# Altium schematic sheet 11_RSSI2.SchDoc: RSSI2
size A3; Organization: Lime Microsystems; Address1: Surrey Tech Centre; Address2: Guildford GU2 7YG; Address3: Surrey; Address4: United Kingdom; Revision: v1.2; SheetNumber: 9; SheetTotal: 27
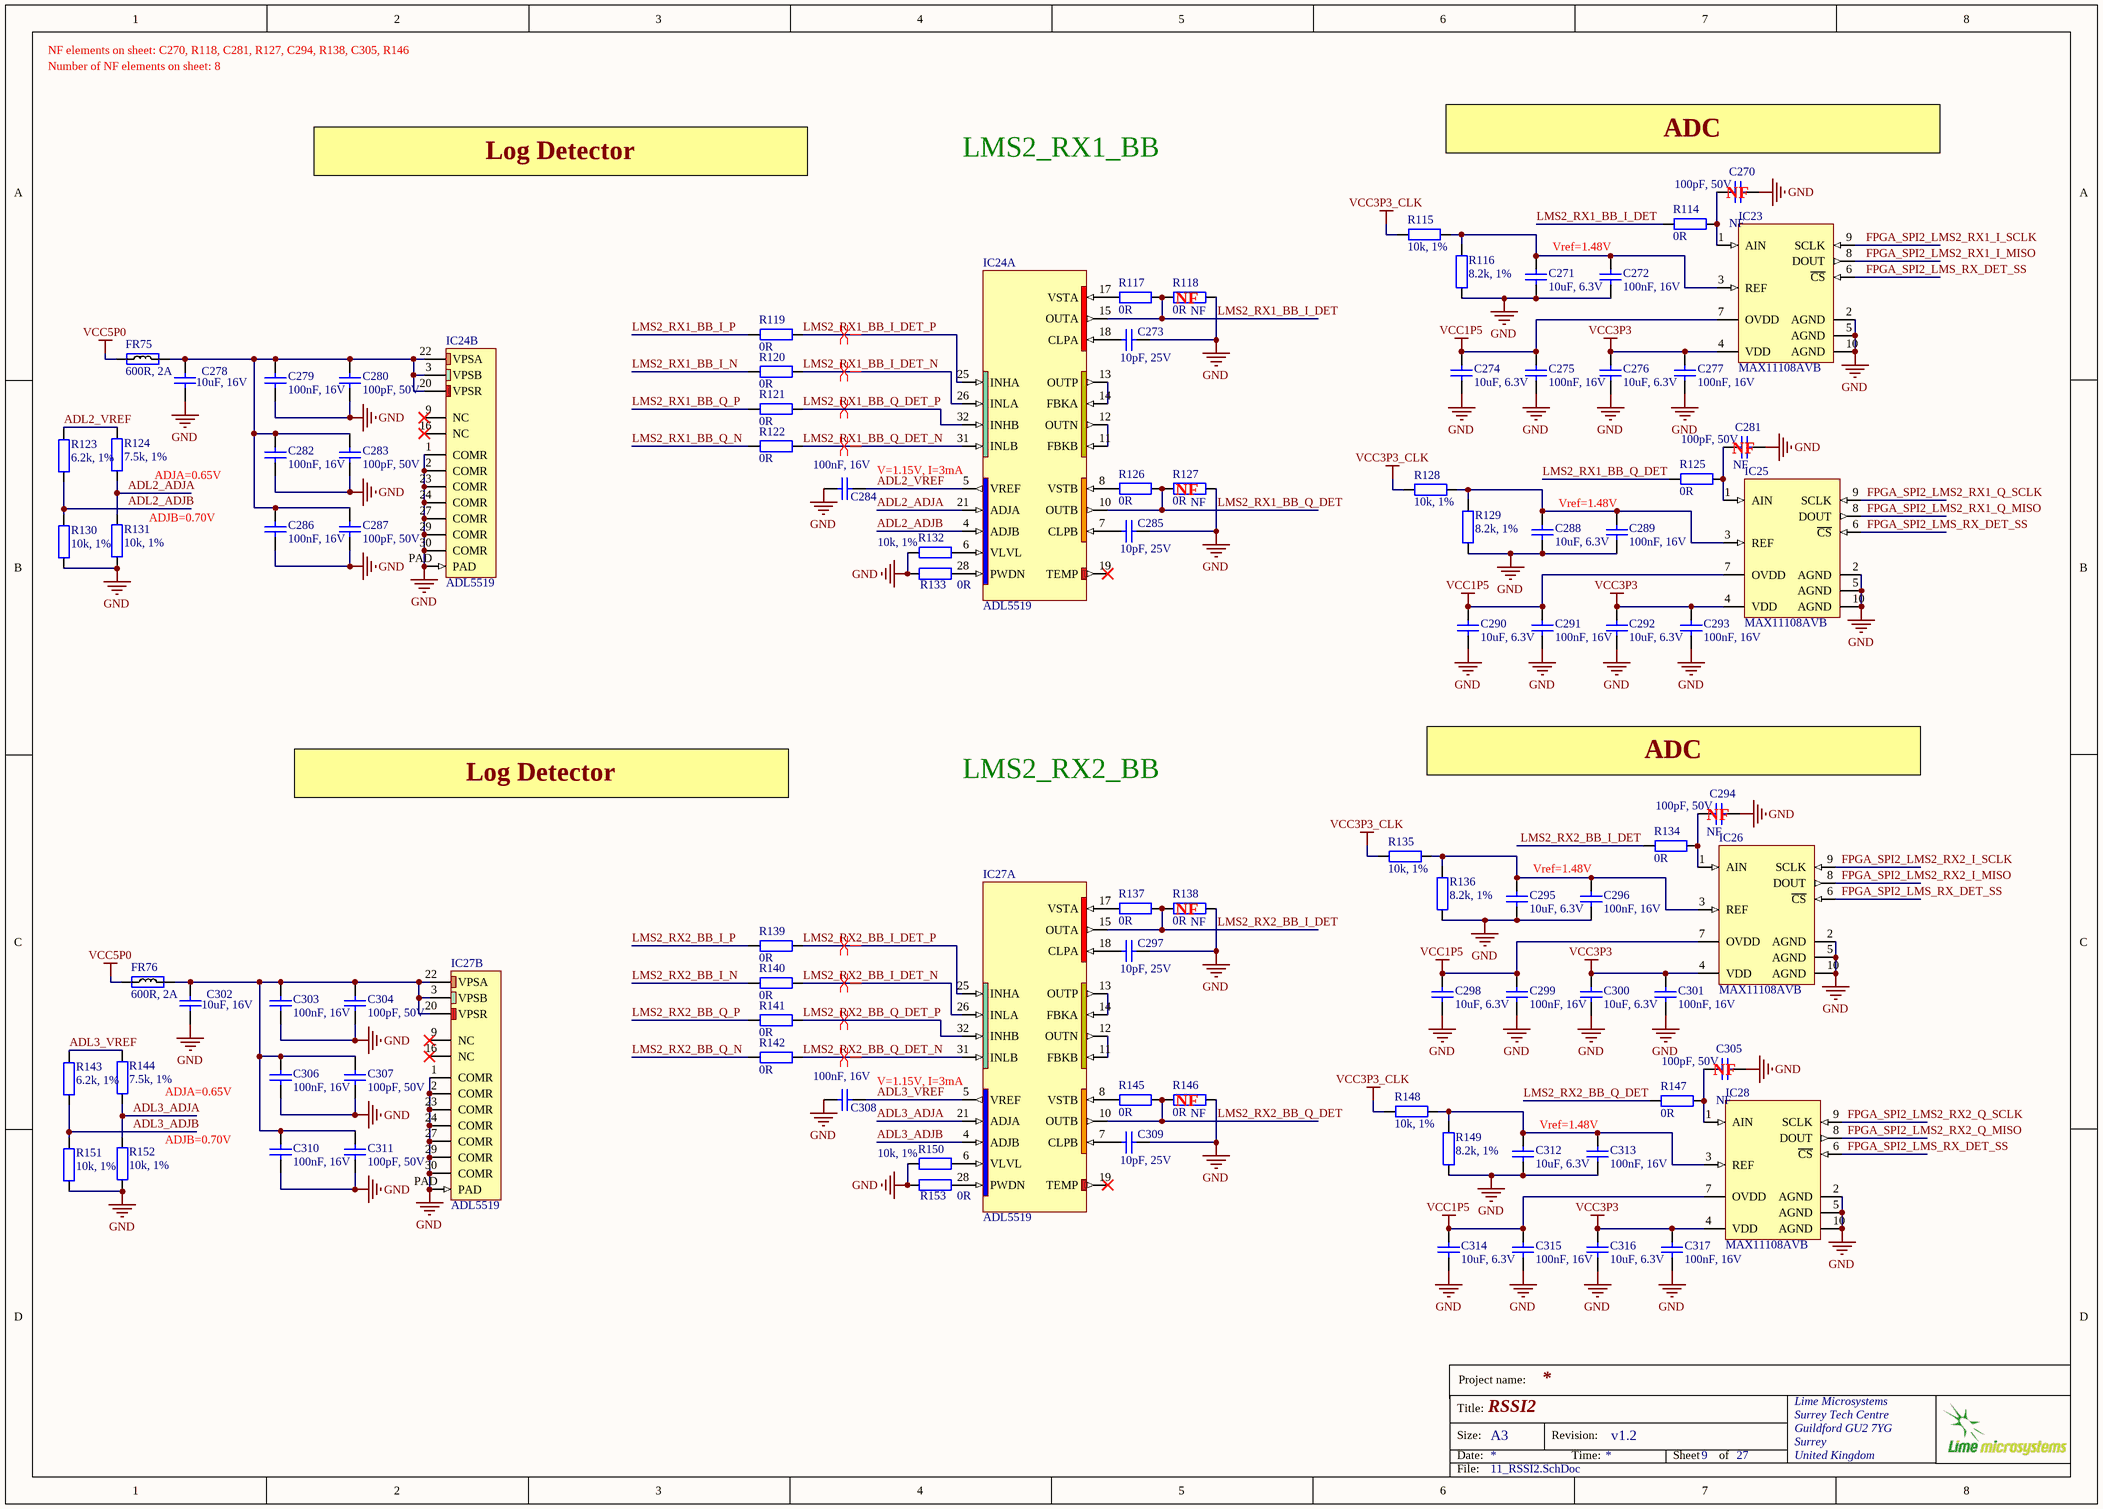
[diagram p0: 11_RSSI2.SchDoc]

## Parts
C270  100pF, 50V  Assembly Info: NF  [CAP0402]
C271  10uF, 6.3V  [CAP0603]
C272  100nF, 16V  [CAP0402]
C273  10pF, 25V  [CAP0402]
C274  10uF, 6.3V  [CAP0603]
C275  100nF, 16V  [CAP0402]
C276  10uF, 6.3V  [CAP0603]
C277  100nF, 16V  [CAP0402]
C278  10uF, 16V  [CAP0603]
C279  100nF, 16V  [CAP0402]
C280  100pF, 50V  [CAP0402]
C281  100pF, 50V  Assembly Info: NF  [CAP0402]
C282  100nF, 16V  [CAP0402]
C283  100pF, 50V  [CAP0402]
C284  100nF, 16V  [CAP0402]
C285  10pF, 25V  [CAP0402]
C286  100nF, 16V  [CAP0402]
C287  100pF, 50V  [CAP0402]
C288  10uF, 6.3V  [CAP0603]
C289  100nF, 16V  [CAP0402]
C290  10uF, 6.3V  [CAP0603]
C291  100nF, 16V  [CAP0402]
C292  10uF, 6.3V  [CAP0603]
C293  100nF, 16V  [CAP0402]
C294  100pF, 50V  Assembly Info: NF  [CAP0402]
C295  10uF, 6.3V  [CAP0603]
C296  100nF, 16V  [CAP0402]
C297  10pF, 25V  [CAP0402]
C298  10uF, 6.3V  [CAP0603]
C299  100nF, 16V  [CAP0402]
C300  10uF, 6.3V  [CAP0603]
C301  100nF, 16V  [CAP0402]
C302  10uF, 16V  [CAP0603]
C303  100nF, 16V  [CAP0402]
C304  100pF, 50V  [CAP0402]
C305  100pF, 50V  Assembly Info: NF  [CAP0402]
C306  100nF, 16V  [CAP0402]
C307  100pF, 50V  [CAP0402]
C308  100nF, 16V  [CAP0402]
C309  10pF, 25V  [CAP0402]
C310  100nF, 16V  [CAP0402]
C311  100pF, 50V  [CAP0402]
C312  10uF, 6.3V  [CAP0603]
C313  100nF, 16V  [CAP0402]
C314  10uF, 6.3V  [CAP0603]
C315  100nF, 16V  [CAP0402]
C316  10uF, 6.3V  [CAP0603]
C317  100nF, 16V  [CAP0402]
FR75  600R, 2A  [RES0805]
FR76  600R, 2A  [RES0805]
IC23  MAX11108AVB  [MAX11108AVB+T]
IC24  ADL5519  [ADL5519_32LFCSP]  (parts A,B of 2)
IC25  MAX11108AVB  [MAX11108AVB+T]
IC26  MAX11108AVB  [MAX11108AVB+T]
IC27  ADL5519  [ADL5519_32LFCSP]  (parts A,B of 2)
IC28  MAX11108AVB  [MAX11108AVB+T]
R114  0R  [RES0402]
R115  10k, 1%  [RES0402]
R116  8.2k, 1%  [RES0402]
R117  0R  [RES0402]
R118  0R  Assembly Info: NF  [RES0402]
R119  0R  [RES0402]
R120  0R  [RES0402]
R121  0R  [RES0402]
R122  0R  [RES0402]
R123  6.2k, 1%  [RES0402]
R124  7.5k, 1%  [RES0402]
R125  0R  [RES0402]
R126  0R  [RES0402]
R127  0R  Assembly Info: NF  [RES0402]
R128  10k, 1%  [RES0402]
R129  8.2k, 1%  [RES0402]
R130  10k, 1%  [RES0402]
R131  10k, 1%  [RES0402]
R132  10k, 1%  [RES0402]
R133  0R  [RES0402]
R134  0R  [RES0402]
R135  10k, 1%  [RES0402]
R136  8.2k, 1%  [RES0402]
R137  0R  [RES0402]
R138  0R  Assembly Info: NF  [RES0402]
R139  0R  [RES0402]
R140  0R  [RES0402]
R141  0R  [RES0402]
R142  0R  [RES0402]
R143  6.2k, 1%  [RES0402]
R144  7.5k, 1%  [RES0402]
R145  0R  [RES0402]
R146  0R  Assembly Info: NF  [RES0402]
R147  0R  [RES0402]
R148  10k, 1%  [RES0402]
R149  8.2k, 1%  [RES0402]
R150  10k, 1%  [RES0402]
R151  10k, 1%  [RES0402]
R152  10k, 1%  [RES0402]
R153  0R  [RES0402]

## Nets
GND: C270.1 C271.1 C272.2 C273.2 C274.1 C275.2 C276.1 C277.2 C278.1 C279.1 C280.1 C281.1 C282.1 C283.1 C284.2 C285.2 C286.1 C287.1 C288.1 C289.2 C290.1 C291.2 C292.1 C293.2 C294.1 C295.1 C296.2 C297.2 C298.1 C299.2 C300.1 C301.2 C302.1 C303.1 C304.1 C305.1 C306.1 C307.1 C308.2 C309.2 C310.1 C311.1 C312.1 C313.2 C314.1 C315.2 C316.1 C317.2 IC23.2(AGND) IC23.5(AGND) IC23.10(AGND) IC24.1(COMR) IC24.2(COMR) IC24.23(COMR) IC24.24(COMR) IC24.27(COMR) IC24.29(COMR) IC24.30(COMR) IC24.PAD IC25.2(AGND) IC25.5(AGND) IC25.10(AGND) IC26.2(AGND) IC26.5(AGND) IC26.10(AGND) IC27.1(COMR) IC27.2(COMR) IC27.23(COMR) IC27.24(COMR) IC27.27(COMR) IC27.29(COMR) IC27.30(COMR) IC27.PAD IC28.2(AGND) IC28.5(AGND) IC28.10(AGND) R116.1 R118.1 R127.1 R129.1 R130.1 R131.2 R132.2 R133.2 R136.1 R138.1 R146.1 R149.1 R150.2 R151.1 R152.2 R153.2
VCC1P5: C274.2 C275.1 C290.2 C291.1 C298.2 C299.1 C314.2 C315.1 IC23.7(OVDD) IC25.7(OVDD) IC26.7(OVDD) IC28.7(OVDD)
VCC3P3: C276.2 C277.1 C292.2 C293.1 C300.2 C301.1 C316.2 C317.1 IC23.4(VDD) IC25.4(VDD) IC26.4(VDD) IC28.4(VDD)
VCC3P3_CLK: R115.2 R128.2 R135.2 R148.2
VCC5P0: FR75.1 FR76.1
ADL2_ADJA: IC24.21(ADJA) R124.1 R131.1
ADL2_ADJB: IC24.4(ADJB) R123.1 R130.2
ADL2_VREF: C284.1 IC24.5(VREF) R123.2 R124.2
ADL3_ADJA: IC27.21(ADJA) R144.1 R152.1
ADL3_ADJB: IC27.4(ADJB) R143.1 R151.2
ADL3_VREF: C308.1 IC27.5(VREF) R143.2 R144.2
FPGA_SPI2_LMS2_RX1_I_MISO: IC23.8(DOUT)
FPGA_SPI2_LMS2_RX1_I_SCLK: IC23.9(SCLK)
FPGA_SPI2_LMS2_RX1_Q_MISO: IC25.8(DOUT)
FPGA_SPI2_LMS2_RX1_Q_SCLK: IC25.9(SCLK)
FPGA_SPI2_LMS2_RX2_I_MISO: IC26.8(DOUT)
FPGA_SPI2_LMS2_RX2_I_SCLK: IC26.9(SCLK)
FPGA_SPI2_LMS2_RX2_Q_MISO: IC28.8(DOUT)
FPGA_SPI2_LMS2_RX2_Q_SCLK: IC28.9(SCLK)
FPGA_SPI2_LMS_RX_DET_SS: IC23.6(~{CS}) IC25.6(~{CS}) IC26.6(~{CS}) IC28.6(~{CS})
LMS2_RX1_BB_I_DET: IC24.15(OUTA) R114.2 R117.1 R118.2
LMS2_RX1_BB_I_DET_N: IC24.26(INLA) R120.1
LMS2_RX1_BB_I_DET_P: IC24.25(INHA) R119.1
LMS2_RX1_BB_I_N: R120.2
LMS2_RX1_BB_I_P: R119.2
LMS2_RX1_BB_Q_DET: IC24.10(OUTB) R125.2 R126.1 R127.2
LMS2_RX1_BB_Q_DET_N: IC24.31(INLB) R122.1
LMS2_RX1_BB_Q_DET_P: IC24.32(INHB) R121.1
LMS2_RX1_BB_Q_N: R122.2
LMS2_RX1_BB_Q_P: R121.2
LMS2_RX2_BB_I_DET: IC27.15(OUTA) R134.2 R137.1 R138.2
LMS2_RX2_BB_I_DET_N: IC27.26(INLA) R140.1
LMS2_RX2_BB_I_DET_P: IC27.25(INHA) R139.1
LMS2_RX2_BB_I_N: R140.2
LMS2_RX2_BB_I_P: R139.2
LMS2_RX2_BB_Q_DET: IC27.10(OUTB) R145.1 R146.2 R147.2
LMS2_RX2_BB_Q_DET_N: IC27.31(INLB) R142.1
LMS2_RX2_BB_Q_DET_P: IC27.32(INHB) R141.1
LMS2_RX2_BB_Q_N: R142.2
LMS2_RX2_BB_Q_P: R141.2
NetC270_2: C270.2 IC23.1(AIN) R114.1
NetC271_2: C271.2 C272.1 IC23.3(REF) R115.1 R116.2
NetC273_1: C273.1 IC24.18(CLPA)
NetC278_2: C278.2 C279.2 C280.2 C282.2 C283.2 C286.2 C287.2 FR75.2 IC24.3(VPSB) IC24.20(VPSR) IC24.22(VPSA)
NetC281_2: C281.2 IC25.1(AIN) R125.1
NetC285_1: C285.1 IC24.7(CLPB)
NetC288_2: C288.2 C289.1 IC25.3(REF) R128.1 R129.2
NetC294_2: C294.2 IC26.1(AIN) R134.1
NetC295_2: C295.2 C296.1 IC26.3(REF) R135.1 R136.2
NetC297_1: C297.1 IC27.18(CLPA)
NetC302_2: C302.2 C303.2 C304.2 C306.2 C307.2 C310.2 C311.2 FR76.2 IC27.3(VPSB) IC27.20(VPSR) IC27.22(VPSA)
NetC305_2: C305.2 IC28.1(AIN) R147.1
NetC309_1: C309.1 IC27.7(CLPB)
NetC312_2: C312.2 C313.1 IC28.3(REF) R148.1 R149.2
NetIC24_6: IC24.6(VLVL) R132.1
NetIC24_8: IC24.8(VSTB) R126.2
NetIC24_11: IC24.11(FBKB) IC24.12(OUTN)
NetIC24_13: IC24.13(OUTP) IC24.14(FBKA)
NetIC24_17: IC24.17(VSTA) R117.2
NetIC24_28: IC24.28(PWDN) R133.1
NetIC27_6: IC27.6(VLVL) R150.1
NetIC27_8: IC27.8(VSTB) R145.2
NetIC27_11: IC27.11(FBKB) IC27.12(OUTN)
NetIC27_13: IC27.13(OUTP) IC27.14(FBKA)
NetIC27_17: IC27.17(VSTA) R137.2
NetIC27_28: IC27.28(PWDN) R153.1

Not connected (* = marked no-connect by the designer): IC24 9(NC)* 16(NC)* 19(TEMP)*; IC27 9(NC)* 16(NC)* 19(TEMP)*

## Layout directives
differential pair: LMS2_RX1_BB_I_DET_N, LMS2_RX1_BB_I_DET_P, LMS2_RX1_BB_Q_DET_N, LMS2_RX1_BB_Q_DET_P, LMS2_RX2_BB_I_DET_N, LMS2_RX2_BB_I_DET_P, LMS2_RX2_BB_Q_DET_N, LMS2_RX2_BB_Q_DET_P

## Notes on the sheet
- NF elements on sheet: C270, R118, C281, R127, C294, R138, C305, R146
- Number of NF elements on sheet: 8
- Log Detector
- LMS2_RX1_BB
- (near C270) ADC
- Vref=1.48V
- (near C270) NF
- (near R118) NF
- ADJA=0.65V
- V=1.15V, I=3mA
- (near R127) NF
- (near C281) NF
- (near R131) ADJB=0.70V
- LMS2_RX2_BB
- (near C294) ADC
- (near C294) NF
- (near R138) NF
- (near R146) NF
- (near C305) NF
- ADJB=0.70V
- Project name:
- Title:
- Size:
- Date:
- A3
- Revision:
- Time:
- Sheet
- of
- File:

## Library data of the parts
C270 C280 C281 C283 C287 C294 C304 C305 C307 C311 = Cap_0402: Manufacturer Part Number 1: CC0402JRNPO9BN101; Manufacturer: Yageo; Part Description: 100pF ±5% 50V C0G, NP0 Ceramic Capacitor -55°C ~ 125°C Surface Mount, MLCC 0402 (1005 Metric) 0.039" L x 0.020" W (1.00mm x 0.50mm); Temperature Coefficient: C0G, NP0; Tolerance: ±5%; Value: 100pF, 50V; Supplier 1: Digi-Key; Supplier Part Number 1: 311-1024-1-ND; RoHS: RoHS Compliant; Category: Capacitors; Applications: General Purpose; Mounting Type: Surface Mount, MLCC; Capacitance: 100pF; Ratings: -; Packaging: Cut Tape (CT); Voltage - Rated: 50V; Size / Dimension: 0.039" L x 0.020" W (1.00mm x 0.50mm); Height - Seated (Max): -; Package / Case: 0402 (1005 Metric); Operating Temperature: -55°C ~ 125°C; Features: -; Lead Spacing: -; Lead Style: -; Thickness (Max): 0.022" (0.55mm)
C271 C274 C276 C288 C290 C292 C295 C298 C300 C312 C314 C316 = Cap_0603: Manufacturer Part Number 1: CC0603MRX5R5BB106; Part Description: 10µF ±20% 6.3V Ceramic Capacitor X5R 0603 (1608 Metric); Manufacturer: Yageo; Capacitance: 10µF; Tolerance: ±20%; Supplier 1: Digi-Key; Supplier Part Number 1: 311-1448-2-ND; Package / Case: 0603 (1608 Metric); Category: Capacitors; Voltage - Rated: 6.3V; Value: 10uF, 6.3V
C272 C275 C277 C279 C282 C284 C286 C289 C291 C293 C296 C299 C301 C303 C306 C308 C310 C313 C315 C317 = Cap_0402: Manufacturer: Murata Electronics; Manufacturer Part Number: GRM155R71C104KA88D; Part Description: 0.10µF ±10% 16V Ceramic Capacitor X7R 0402 (1005 Metric); Tolerance: 10 %; Type: General Purpose MLCC; Capacitance: 0.1 uF; Case Length: 1 mm; Dielectric: X7R; Case Height: 0.5 mm; Temperature Coefficient / Code: +/- 15 %; Value: 100nF, 16V; Supplier 1: Mouser; Supplier Part Number 1: 81-GRM155R71C104KA88; Case Code - in: 0402; RoHS: RoHS Compliant; Operating Temperature Range: - 55 C to + 125 C; Series: GRM; Termination Style: SMD/SMT; Package / Case: 0402 (1005 metric); Voltage Rating DC: 16 V; Maximum Operating Temperature: + 125 C; Case Code - mm: 1005; Minimum Operating Temperature: - 55 C; Product Category: Low & Medium Capacitance SMD Ceramic Chip Capacitors; Packaging: Reel; Product: General Type MLCCs; Category: Multilayer Ceramic Capacitors MLCC - SMD/SMT; Brand: Murata Electronics; Case Width: 0.5 mm; RoHS - Mouser: Y; Standard Pack Qty: 10000; Minimum Order Quantity: 1; Reeling: True; Manufacturer Part Number 1: GRM155R71C104KA88D
C273 C285 C297 C309 = Cap_0402: Manufacturer Part Number 1: 04023A100JAT2A; Manufacturer: AVX; Part Description: 10pF ±5% 25V Ceramic Capacitor C0G, NP0 0402 (1005 Metric); Capacitance Tolerance: ± 5%; Voltage Rating: 25; Ceramic Capacitor Case: 0402 [1005 Metric]; Capacitor Case Style: 0402 [1005 Metric]<!--FANDB--><div class="features-and-benefits-container"></div>; Dielectric Characteristic: C0G / NP0; SVHC: No SVHC (16-Jun-2014); Capacitance: 10; Value: 10pF, 25V; Supplier 1: Farnell; Supplier Part Number 1: 2332478RL; Product Range: -; RoHS: YES; Operating Temperature Min: -55; Operating Temperature Max: 125; Capacitance Tolerance ±: ± 5%; MSL: MSL 1 - Unlimited; Packaging: Cut Tape
C278 C302 = Cap_0603: Manufacturer: Yageo; Manufacturer Part Number 1: GRM188R61C106MA73D; Part Description: 10µF ±20% 16V Ceramic Capacitor X5R 0603 (1608 Metric); Temperature Coefficient: X5R; Capacitance: 10µF; Tolerance: ±20%; Value: 10uF, 16V; Supplier 1: Digi-Key; Supplier Part Number 1: 490-7201-2-ND; Category: Capacitors; Ratings: -; Features: -; Lead Style: -; Package / Case: 0603 (1608 Metric); Lead Spacing: -; Applications: General Purpose; Voltage - Rated: 16V; Operating Temperature: -55°C ~ 85°C; Thickness (Max): 0.039" (1.00mm); Mounting Type: Surface Mount, MLCC; RoHS: RoHS Compliant; Size / Dimension: 0.063" L x 0.031" W (1.60mm x 0.80mm); Packaging: Tape & Reel (TR); Height - Seated (Max): -
FR75 FR76 = Ferrite: Manufacturer Part Number 1: MPZ2012S601A; Manufacturer: TDK; Part Description: FERRITE BEAD 600 OHM 0805 1LN; Filter Type: Differential Mode - Single; Impedance @ Frequency: 600 Ohm @ 100MHz; DC Resistance (DCR): 100 mOhm Max; DC Current Rating: 2; DC Resistance Max: 0.1; Ferrite Case Style: 0805 [2012 Metric]; Ferrite Mounting: SMD; Impedance @ 100MHz: 600; Impedance Tolerance: ± 25%; Supplier 1: Farnell; Supplier Part Number 1: 1669753RL; Mounting Type: Surface Mount; RoHS: RoHS Compliant; Height (Max): 0.041" (1.05mm); Packaging: Tape & Reel (TR); Category: Filters; Current Rating: 2A; Package / Case: 0805 (2012 Metric); Size / Dimension: 0.079" L x 0.049" W (2.00mm x 1.25mm); Value: 600R, 2A; Core Material: Ferrite; Supplier: Farnell
IC23 IC25 IC26 IC28 = MAX11108AVB+T: Part Description: 12 Bit Analog to Digital Converter 1 Input 1 SAR 10-UTQFN (2.1x1.6); Manufacturer: Maxim Integrated; Number of Bits: 12; Sampling Rate (Per Second): 3M; Number of Inputs: 1; Input Type: Single Ended; Data Interface: SPI; Configuration: S/H-ADC; Ratio - S/H:ADC: 1:1; Architecture: SAR; Reference Type: External; Voltage - Supply, Analog: 2.2 V ~ 3.6 V; Supplier 1: Digi-Key; Manufacturer Part Number 1: MAX11108AVB+T; RoHS: RoHS Compliant; Category: Integrated Circuits (ICs); Stock 1: 4253; Pricing 1: 1=4.05, 10=3.825, 25=3.06, 50=2.907, 100=2.6775, 250=2.5398, 500=2.44802 (USD); Packaging: Cut Tape (CT); Part Status: Active; Number of A/D Converters: 1; Voltage - Supply, Digital: 2.2 V ~ 3.6 V; Features: -; Operating Temperature: -40°C ~ 125°C; Package / Case: 10-UFQFN; Supplier Device Package: 10-UTQFN (2.1x1.6); ComponentLink1URL: http://datasheets.maximintegrated.com/en/ds/MAX11108.pdf; ComponentLink1Description: http://datasheets.maximintegrated.com/en/ds/MAX11108.pdf; Supplier Part Number 1: MAX11108AVB+TCT-ND
IC24 IC27 = ADL5519: Manufacturer: Analog Devices Inc.; Manufacturer Part Number 1: ADL5519ACPZ-R7; Part Description: RF IC Detector/Controller WiMax, WLAN 1MHz ~ 10GHz 32-LFCSP-VQ (5x5); Function: Detector/Controller; Frequency: 1MHz ~ 10GHz; RF Type: WiMax, WLAN; Supplier 1: Digi-Key; RoHS: RoHS Compliant; Category: RF/IF and RFID; Stock 1: 993; Pricing 1: 1=11.11, 10=10.214, 100=8.626, 500=7.6734 (USD); Packaging: Cut Tape (CT); Part Status: Active; Secondary Attributes: -; Package / Case: 32-VFQFN Exposed Pad, CSP; Supplier Device Package: 32-LFCSP-VQ (5x5); ComponentLink1URL: http://www.analog.com/media/en/technical-documentation/data-sheets/ADL5519.pdf; ComponentLink1Description: http://www.analog.com/media/en/technical-documentation/data-sheets/ADL5519.pdf; Supplier Part Number 1: ADL5519ACPZ-R7CT-ND
R114 R117-R122 R125-R127 R133 R134 R137-R142 R145-R147 R153 = Res_0402: Manufacturer Part Number 1: RC0402JR-070RL; Manufacturer: Yageo; Part Description: RES SMD 0.0OHM JUMPER 1/16W 0402; Resistance (Ohms): 0.0; Tolerance: Jumper; Power (Watts): 0.063W, 1/16W; Value: 0R; Supplier 1: Digi-Key; Supplier Part Number 1: 311-0.0JRTR-ND; Category: Resistors; Temperature Coefficient: -; Features: Moisture Resistant; Supplier Device Package: 0402; Height: 0.016" (0.40mm); Package / Case: 0402 (1005 Metric); Operating Temperature: -55°C ~ 155°C; Size / Dimension: 0.039" L x 0.020" W (1.00mm x 0.50mm); Composition: Thick Film; Packaging: Tape & Reel (TR); Number of Terminations: 2; RoHS: RoHS Compliant
R115 R128 R130-R132 R135 R148 R150-R152 = Res_0402: Manufacturer: Yageo; Manufacturer Part Number 1: RC0402FR-0710KL; Part Description: RES SMD 10K OHM 1% 1/16W 0402; Temperature Coefficient: ±100ppm/°C; Power (Watts): 0.063W, 1/16W; Value: 10k, 1%; Supplier 1: Digi-Key; Supplier Part Number 1: 311-10.0KLRTR-ND; Resistance (Ohms): 10k; Packaging: Tape & Reel (TR); RoHS: RoHS Compliant; Package / Case: 0402 (1005 Metric); Tolerance: ±1%; Operating Temperature: -55°C ~ 155°C; Size / Dimension: 0.039" L x 0.020" W (1.00mm x 0.50mm); Number of Terminations: 2; Category: Resistors; Height: 0.016" (0.40mm); Supplier Device Package: 0402; Features: Moisture Resistant; Composition: Thick Film
R116 R129 R136 R149 = Res_0402: Manufacturer: Yageo; Part Description: RES SMD 8.2K OHM 1% 1/16W 0402; Manufacturer Part Number 1: RC0402FR-078K2L; Power (Watts): 0.063W, 1/16W; Temperature Coefficient: ±100ppm/°C; Value: 8.2k, 1%; Supplier 1: Digi-Key; Supplier Device Package: 0402; Package / Case: 0402 (1005 Metric); Height: 0.016" (0.40mm); Supplier Part Number 1: 311-8.20KLRCT-ND; Number of Terminations: 2; Operating Temperature: -55°C ~ 155°C; Resistance (Ohms): 8.2k; Size / Dimension: 0.039" L x 0.020" W (1.00mm x 0.50mm); Composition: Thick Film; Category: Resistors; Tolerance: ±1%; Features: Moisture Resistant; RoHS: RoHS Compliant; Packaging: Cut Tape (CT)
R123 R143 = Res_0402: Manufacturer: Yageo; Manufacturer Part Number: RC0402FR-076K2L; Part Description: ±1% 0.063W, 1/16W Chip Resistor 0402 (1005 Metric) Moisture Resistant Thick Film; Temperature Coefficient: ±100ppm/°C; Power (Watts): 0.063W, 1/16W; Value: 6.2k, 1%; Supplier Device Package: 0402; Package / Case: 0402 (1005 Metric); Failure Rate: -; Operating Temperature: -55°C ~ 155°C; Height - Seated (Max): 0.016" (0.40mm); Tolerance: ±1%; Category: Resistors; Part Status: Active; Packaging: Cut Tape (CT); RoHS: RoHS Compliant; Size / Dimension: 0.039" L x 0.020" W (1.00mm x 0.50mm); Supplier 1: Digi-Key; Supplier Part Number 1: 311-6.20KLRCT-ND; Features: Moisture Resistant; Composition: Thick Film
R124 R144 = Res_0402: Manufacturer Part Number: RC0402FR-077K5L; Manufacturer: Yageo; Part Description: ±1% 0.063W, 1/16W Chip Resistor 0402 (1005 Metric) Automotive AEC-Q200, Moisture Resistant Thick Film; Power (Watts): 0.063W, 1/16W; Temperature Coefficient: ±100ppm/°C; Value: 7.5k, 1%; Packaging: Cut Tape (CT); Tolerance: ±1%; RoHS: RoHS Compliant; Supplier Device Package: 0402; Size / Dimension: 0.039" L x 0.020" W (1.00mm x 0.50mm); Category: Resistors; Failure Rate: -; Supplier 1: Digi-Key; Composition: Thick Film; Package / Case: 0402 (1005 Metric); Supplier Part Number 1: YAG3512CT-ND; Features: Automotive AEC-Q200, Moisture Resistant; Height - Seated (Max): 0.015" (0.37mm); Part Status: Active; Operating Temperature: -55°C ~ 155°C